# Altium schematic sheet Main_Board1.SchDoc
size A2
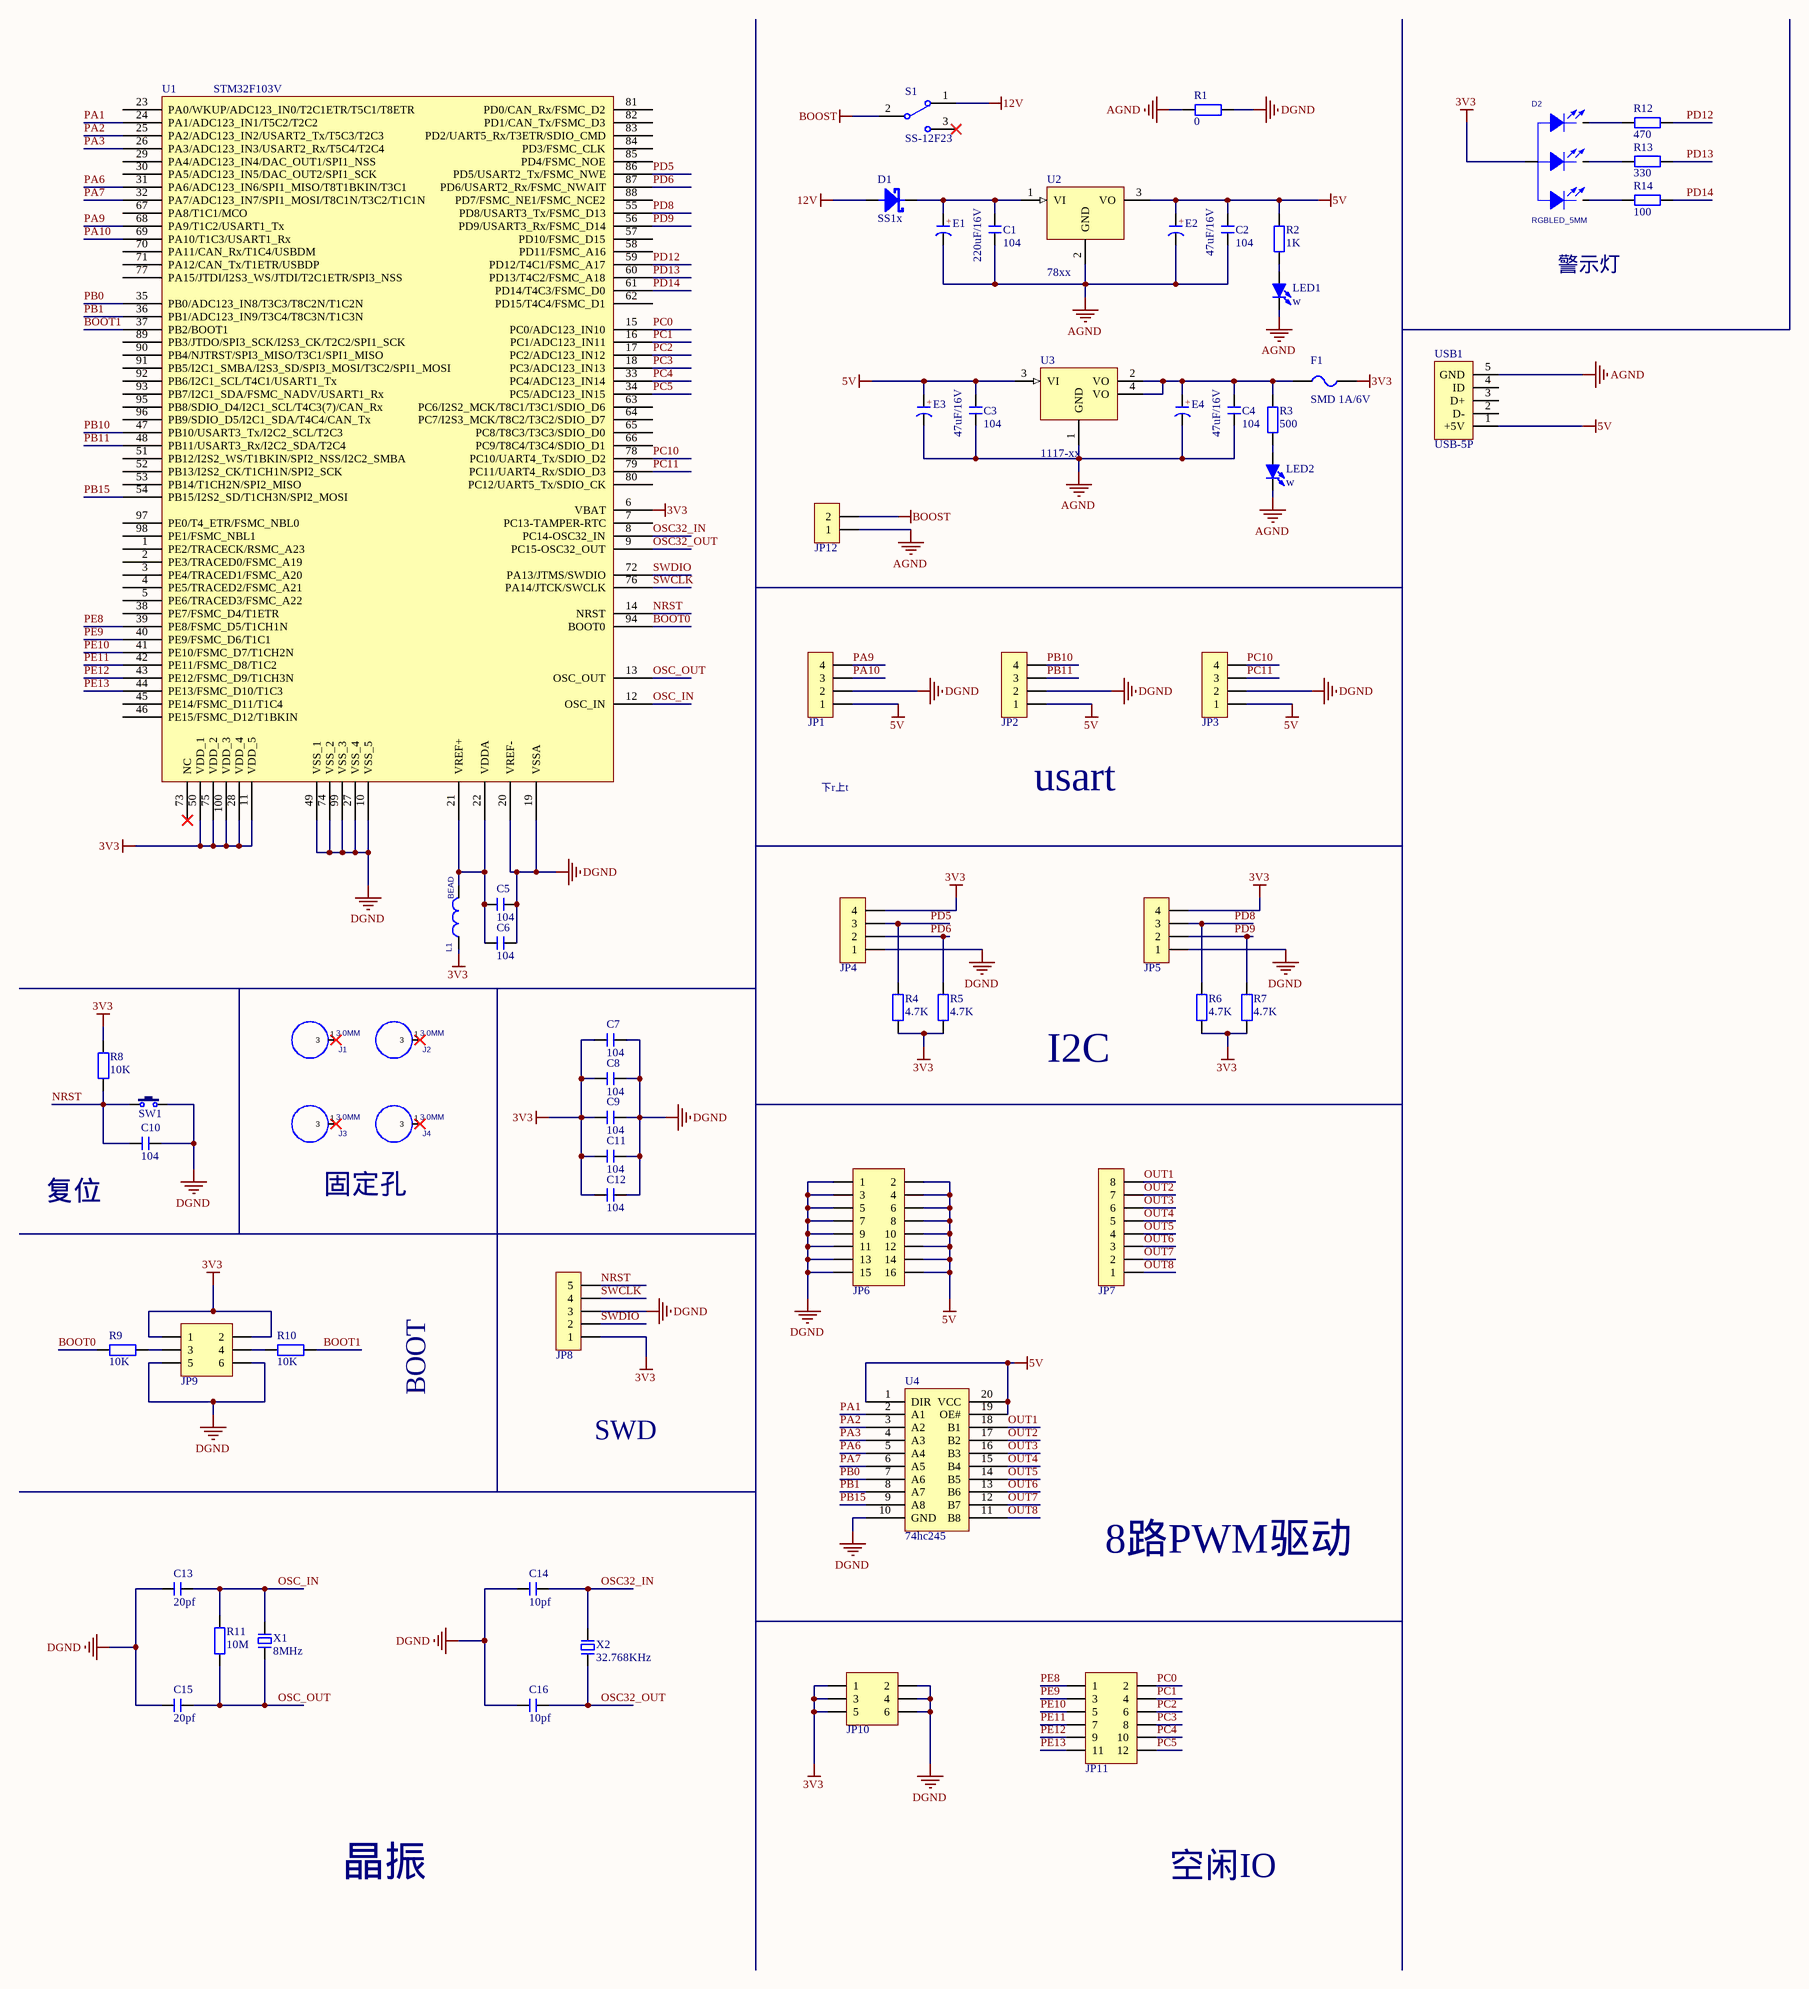
[diagram p0: Main_Board1.SchDoc]

## Parts
C1  104  [C 0603]
C2  104  [C 0603]
C3  104  [C 0603]
C4  104  [C 0603]
C5  104  [C 0603]
C6  104  [C 0603]
C7  104  [C 0603]
C8  104  [C 0603]
C9  104  [C 0603]
C10  104  [C 0603]
C11  104  [C 0603]
C12  104  [C 0603]
C13  20pf  [C 0603]
C14  10pf  [C 0603]
C15  20pf  [C 0603]
C16  10pf  [C 0603]
D1  SS1x  [SMA]
D2  value RGBLED_5MM  [LED_RGB_5MM]  (hidden comment: LED_RGB_5MM)
E1  220uF/16V  [CD A(3216)]
E2  47uF/16V  [CD A(3216)]
E3  47uF/16V  [CD A(3216)]
E4  47uF/16V  [CD A(3216)]
F1  SMD 1A/6V  [FU 0805]
J1  3.0MM  [3.0MM-5]
J2  3.0MM  [3.0MM-5]
J3  3.0MM  [3.0MM-5]
J4  3.0MM  [3.0MM-5]
JP1  HDR-1X4  [HDR-1X4]  (value not drawn)
JP2  HDR-1X4  [HDR-1X4]  (value not drawn)
JP3  HDR-1X4  [HDR-1X4]  (value not drawn)
JP4  HDR-1X4  [HDR-1X4]  (value not drawn)
JP5  HDR-1X4  [HDR-1X4]  (value not drawn)
JP6  Header 8X2  [HDR-8X2]  (value not drawn)
JP7  HDR-1X8  [HDR-1X8]  (value not drawn)
JP8  HDR-1X5  [XH2.54-5P]  (value not drawn)
JP9  Header3X2  [HDR-3X2]  (value not drawn)
JP10  Header3X2  [HDR-3X2]  (value not drawn)
JP11  Header 6X2  [HDR-6X2]  (value not drawn)
JP12  HDR-1X2  [KF128-5.08-2P]  (value not drawn)
L1  value BEAD  [L0603]  (hidden comment: BEAD-220/100MHZ-0603)
LED1  w  [LED 0603W]
LED2  w  [LED 0603W]
R1  0  [R 0603]
R2  1K  [R 0603]
R3  500  [R 0603]
R4  4.7K  [R 0603]
R5  4.7K  [R 0603]
R6  4.7K  [R 0603]
R7  4.7K  [R 0603]
R8  10K  [R 0603]
R9  10K  [R 0603]
R10  10K  [R 0603]
R11  10M  [R 0603]
R12  470  [R 0603]
R13  330  [R 0603]
R14  100  [R 0603]
S1  SS-12F23  [SS-12D10]
SW1  3x6x5  [TSW SMD-3*6*2.5]  (value not drawn)
U1  STM32F103V  [LQFP100 14X14_N]
U2  78xx  [TO252]
U3  1117-xx  [SOT223_M]
U4  74hc245  [SOP20_L]
USB1  USB-5P  [USB-MICRO_A]
X1  8MHz  [XTAL-49S SMD]
X2  32.768KHz  [XTAL-3215]

## Nets
3V3: C7.1 C8.1 C9.1 C11.1 C12.1 D2.1(G) F1.2 JP4.4 JP5.4 JP8.1 JP9.1 JP9.2 JP10.1 JP10.3 JP10.5 L1.1 R4.1 R5.1 R6.1 R7.1 R8.2 U1.6(VBAT) U1.11(VDD_5) U1.28(VDD_4) U1.50(VDD_1) U1.75(VDD_2) U1.100(VDD_3)
5V: C2.2 C3.2 E2.1(A) E3.1(A) JP1.1 JP2.1 JP3.1 JP6.2 JP6.4 JP6.6 JP6.8 JP6.10 JP6.12 JP6.14 JP6.16 R2.2 U2.3(VO) U3.3(VI) U4.1(DIR) U4.19(OE#) U4.20(VCC) USB1.1(+5V)
12V: D1.1(A) S1.1
AGND: C1.1 C2.1 C3.1 C4.1 E1.2(K) E2.2(K) E3.2(K) E4.2(K) JP12.1 LED1.2(K) LED2.2(K) R1.2 U2.2(GND) U3.1(GND) USB1.5(GND)
BOOST: JP12.2 S1.2
DGND: C5.2 C6.2 C7.2 C8.2 C9.2 C10.2 C11.2 C12.2 C13.1 C14.1 C15.1 C16.1 JP1.2 JP2.2 JP3.2 JP4.1 JP5.1 JP6.1 JP6.3 JP6.5 JP6.7 JP6.9 JP6.11 JP6.13 JP6.15 JP8.3 JP9.5 JP9.6 JP10.2 JP10.4 JP10.6 R1.1 SW1.2 U1.10(VSS_5) U1.19(VSSA) U1.20(VREF-) U1.27(VSS_4) U1.49(VSS_1) U1.74(VSS_2) U1.99(VSS_3) U4.10(GND)
BOOT0: R9.2 U1.94(BOOT0)
BOOT1: R10.1 U1.37(PB2/BOOT1)
NRST: C10.1 JP8.5 R8.1 SW1.1 U1.14(NRST)
OSC32_IN: C14.2 U1.8(PC14-OSC32_IN) X2.2
OSC32_OUT: C16.2 U1.9(PC15-OSC32_OUT) X2.1
OSC_IN: C13.2 R11.1 U1.12(OSC_IN) X1.2
OSC_OUT: C15.2 R11.2 U1.13(OSC_OUT) X1.1
OUT1: JP7.8 U4.18(B1)
OUT2: JP7.7 U4.17(B2)
OUT3: JP7.6 U4.16(B3)
OUT4: JP7.5 U4.15(B4)
OUT5: JP7.4 U4.14(B5)
OUT6: JP7.3 U4.13(B6)
OUT7: JP7.2 U4.12(B7)
OUT8: JP7.1 U4.11(B8)
PA1: U1.24(PA1/ADC123_IN1/T5C2/T2C2) U4.2(A1)
PA2: U1.25(PA2/ADC123_IN2/USART2_Tx/T5C3/T2C3) U4.3(A2)
PA3: U1.26(PA3/ADC123_IN3/USART2_Rx/T5C4/T2C4) U4.4(A3)
PA6: U1.31(PA6/ADC123_IN6/SPI1_MISO/T8T1BKIN/T3C1) U4.5(A4)
PA7: U1.32(PA7/ADC123_IN7/SPI1_MOSI/T8C1N/T3C2/T1C1N) U4.6(A5)
PA9: JP1.4 U1.68(PA9/T1C2/USART1_Tx)
PA10: JP1.3 U1.69(PA10/T1C3/USART1_Rx)
PB0: U1.35(PB0/ADC123_IN8/T3C3/T8C2N/T1C2N) U4.7(A6)
PB1: U1.36(PB1/ADC123_IN9/T3C4/T8C3N/T1C3N) U4.8(A7)
PB10: JP2.4 U1.47(PB10/USART3_Tx/I2C2_SCL/T2C3)
PB11: JP2.3 U1.48(PB11/USART3_Rx/I2C2_SDA/T2C4)
PB15: U1.54(PB15/I2S2_SD/T1CH3N/SPI2_MOSI) U4.9(A8)
PC0: JP11.2 U1.15(PC0/ADC123_IN10)
PC1: JP11.4 U1.16(PC1/ADC123_IN11)
PC2: JP11.6 U1.17(PC2/ADC123_IN12)
PC3: JP11.8 U1.18(PC3/ADC123_IN13)
PC4: JP11.10 U1.33(PC4/ADC123_IN14)
PC5: JP11.12 U1.34(PC5/ADC123_IN15)
PC10: JP3.4 U1.78(PC10/UART4_Tx/SDIO_D2)
PC11: JP3.3 U1.79(PC11/UART4_Rx/SDIO_D3)
PD5: JP4.3 R4.2 U1.86(PD5/USART2_Tx/FSMC_NWE)
PD6: JP4.2 R5.2 U1.87(PD6/USART2_Rx/FSMC_NWAIT)
PD8: JP5.3 R6.2 U1.55(PD8/USART3_Tx/FSMC_D13)
PD9: JP5.2 R7.2 U1.56(PD9/USART3_Rx/FSMC_D14)
PD12: R12.2 U1.59(PD12/T4C1/FSMC_A17)
PD13: R13.2 U1.60(PD13/T4C2/FSMC_A18)
PD14: R14.2 U1.61(PD14/T4C3/FSMC_D0)
PE8: JP11.1 U1.39(PE8/FSMC_D5/T1CH1N)
PE9: JP11.3 U1.40(PE9/FSMC_D6/T1C1)
PE10: JP11.5 U1.41(PE10/FSMC_D7/T1CH2N)
PE11: JP11.7 U1.42(PE11/FSMC_D8/T1C2)
PE12: JP11.9 U1.43(PE12/FSMC_D9/T1CH3N)
PE13: JP11.11 U1.44(PE13/FSMC_D10/T1C3)
SWCLK: JP8.4 U1.76(PA14/JTCK/SWCLK)
SWDIO: JP8.2 U1.72(PA13/JTMS/SWDIO)
NetC1_2: C1.2 D1.2(C) E1.1(A) U2.1(VI)
NetC4_2: C4.2 E4.1(A) F1.1 R3.2 U3.2(VO) U3.4(VO)
NetC5_1: C5.1 C6.1 L1.2 U1.21(VREF+) U1.22(VDDA)
NetD2_2: D2.2(G) R12.1
NetD2_3: D2.3(R) R13.1
NetD2_4: D2.4(R) R14.1
NetJP9_3: JP9.3 R9.1
NetJP9_4: JP9.4 R10.2
NetLED1_1: LED1.1(A) R2.1
NetLED2_1: LED2.1(A) R3.1

Not connected (* = marked no-connect by the designer): J1 1(3)*; J2 1(3)*; J3 1(3)*; J4 1(3)*; S1 3*; U1 1(PE2/TRACECK/RSMC_A23) 2(PE3/TRACED0/FSMC_A19) 3(PE4/TRACED1/FSMC_A20) 4(PE5/TRACED2/FSMC_A21) 5(PE6/TRACED3/FSMC_A22) 7(PC13-TAMPER-RTC) 23(PA0/WKUP/ADC123_IN0/T2C1ETR/T5C1/T8ETR) 29(PA4/ADC123_IN4/DAC_OUT1/SPI1_NSS) 30(PA5/ADC123_IN5/DAC_OUT2/SPI1_SCK) 38(PE7/FSMC_D4/T1ETR) 45(PE14/FSMC_D11/T1C4) 46(PE15/FSMC_D12/T1BKIN) 51(PB12/I2S2_WS/T1BKIN/SPI2_NSS/I2C2_SMBA) 52(PB13/I2S2_CK/T1CH1N/SPI2_SCK) 53(PB14/T1CH2N/SPI2_MISO) 57(PD10/FSMC_D15) 58(PD11/FSMC_A16) 62(PD15/T4C4/FSMC_D1) 63(PC6/I2S2_MCK/T8C1/T3C1/SDIO_D6) 64(PC7/I2S3_MCK/T8C2/T3C2/SDIO_D7) 65(PC8/T8C3/T3C3/SDIO_D0) 66(PC9/T8C4/T3C4/SDIO_D1) 67(PA8/T1C1/MCO) 70(PA11/CAN_Rx/T1C4/USBDM) 71(PA12/CAN_Tx/T1ETR/USBDP) 73(NC)* 77(PA15/JTDI/I2S3_WS/JTDI/T2C1ETR/SPI3_NSS) 80(PC12/UART5_Tx/SDIO_CK) 81(PD0/CAN_Rx/FSMC_D2) 82(PD1/CAN_Tx/FSMC_D3) 83(PD2/UART5_Rx/T3ETR/SDIO_CMD) 84(PD3/FSMC_CLK) 85(PD4/FSMC_NOE) 88(PD7/FSMC_NE1/FSMC_NCE2) 89(PB3/JTDO/SPI3_SCK/I2S3_CK/T2C2/SPI1_SCK) 90(PB4/NJTRST/SPI3_MISO/T3C1/SPI1_MISO) 91(PB5/I2C1_SMBA/I2S3_SD/SPI3_MOSI/T3C2/SPI1_MOSI) 92(PB6/I2C1_SCL/T4C1/USART1_Tx) 93(PB7/I2C1_SDA/FSMC_NADV/USART1_Rx) 95(PB8/SDIO_D4/I2C1_SCL/T4C3(7)/CAN_Rx) 96(PB9/SDIO_D5/I2C1_SDA/T4C4/CAN_Tx) 97(PE0/T4_ETR/FSMC_NBL0) 98(PE1/FSMC_NBL1); USB1 2(D-) 3(D+) 4(ID)

## Notes on the sheet
- 警示灯
- 下r上t
- (near JP2) usart
- I2C
- 复位
- 固定孔
- BOOT
- SWD
- 8路PWM驱动
- 晶振
- 空闲IO
- Title
- Size:
- Date:
- File:
- A2
- Number:
- Time:
- Revision:
- Sheet
- of
- (in symbol C-CD) +

## Library data of the parts
C1-C16 = C: 无极性贴片电容; 版权归属: 源创客; BOM名称: 无极性贴片电容; 学习资源: www.ooocke.com
D1 = SS1x: Schottky Diode
D2 = LED_RGB_5MM: RGB; PCB DECAL: LED_RGB_5MM
E1-E4 = C-CD: 贴片钽电容; 版权归属: 源创客; BOM名称: 贴片钽电容; 学习资源: www.ooocke.com
F1 = FU: 贴片保险丝; 版权归属: 源创客; BOM名称: 贴片保险丝; 学习资源: www.ooocke.com
JP1-JP5 = Header 4: 4P接插件; 版权归属: 源创客; BOM名称: 4P接插件; 学习资源: www.ooocke.com
JP6 = Header 8X2: 8*2P接插件; 版权归属: 源创客; BOM名称: 8*2P接插件; 学习资源: www.ooocke.com
JP7 = Header 8: 8P接插件; 版权归属: 源创客; BOM名称: 8P接插件; 学习资源: www.ooocke.com
JP8 = Header 5: 5P接插件; 版权归属: 源创客; BOM名称: 5P接插件; 学习资源: www.ooocke.com
JP9 JP10 = Header 3X2: 3*2P接插件; 版权归属: 源创客; BOM名称: 3*2P接插件; 学习资源: www.ooocke.com
JP11 = Header  6X2: 6*2P接插件; 版权归属: 源创客; BOM名称: 6*2P接插件; 学习资源: www.ooocke.com
JP12 = Header 2: 2P接插件; 版权归属: 源创客; BOM名称: 2P接插件; 学习资源: www.ooocke.com
L1 = BEAD-220/100MHZ-0603: 0603,BEAD; Manufacturer #1 PN: BEAD; PCB DECAL: L0603
LED1 LED2 = LED-SMD: 贴片LED; 版权归属: 源创客; BOM名称: 贴片LED; 学习资源: www.ooocke.com
R1-R14 = R: 贴片电阻; 版权归属: 源创客; BOM名称: 贴片电阻; 学习资源: www.ooocke.com
S1 = SSW-1P: 1路波动开关; BOM名称: 波动开关; 版权归属: 源创客; 学习资源: www.ooocke.com
SW1 = TSW 3x6: 3x6轻触开关; 版权归属: 源创客; BOM名称: 3x6轻触开关; 学习资源: www.ooocke.com
U1 = STM32F103V: 32位STM单片机100引脚; 版权归属: 源创客; BOM名称: 32位STM单片机100引脚; 学习资源: www.ooocke.com
U2 = 78xx: Linear Regulator
U3 = 1117: Linear Regulator
U4 = 74hc245: 总线收发器
USB1 = USB-5P: 微型USB母座; 版权归属: 源创客; BOM名称: 微型USB母座; 学习资源: www.ooocke.com
X1 X2 = XTAL-2: 2脚晶振; 版权归属: 源创客; BOM名称: 2脚晶振; 学习资源: www.ooocke.com
J1-J4 = 3.0MM: PCB DECAL: 3.0MM-5